# EAGLE design HealthMonitor (EAGLE 9.5.0)

## Sheet 1 of 2
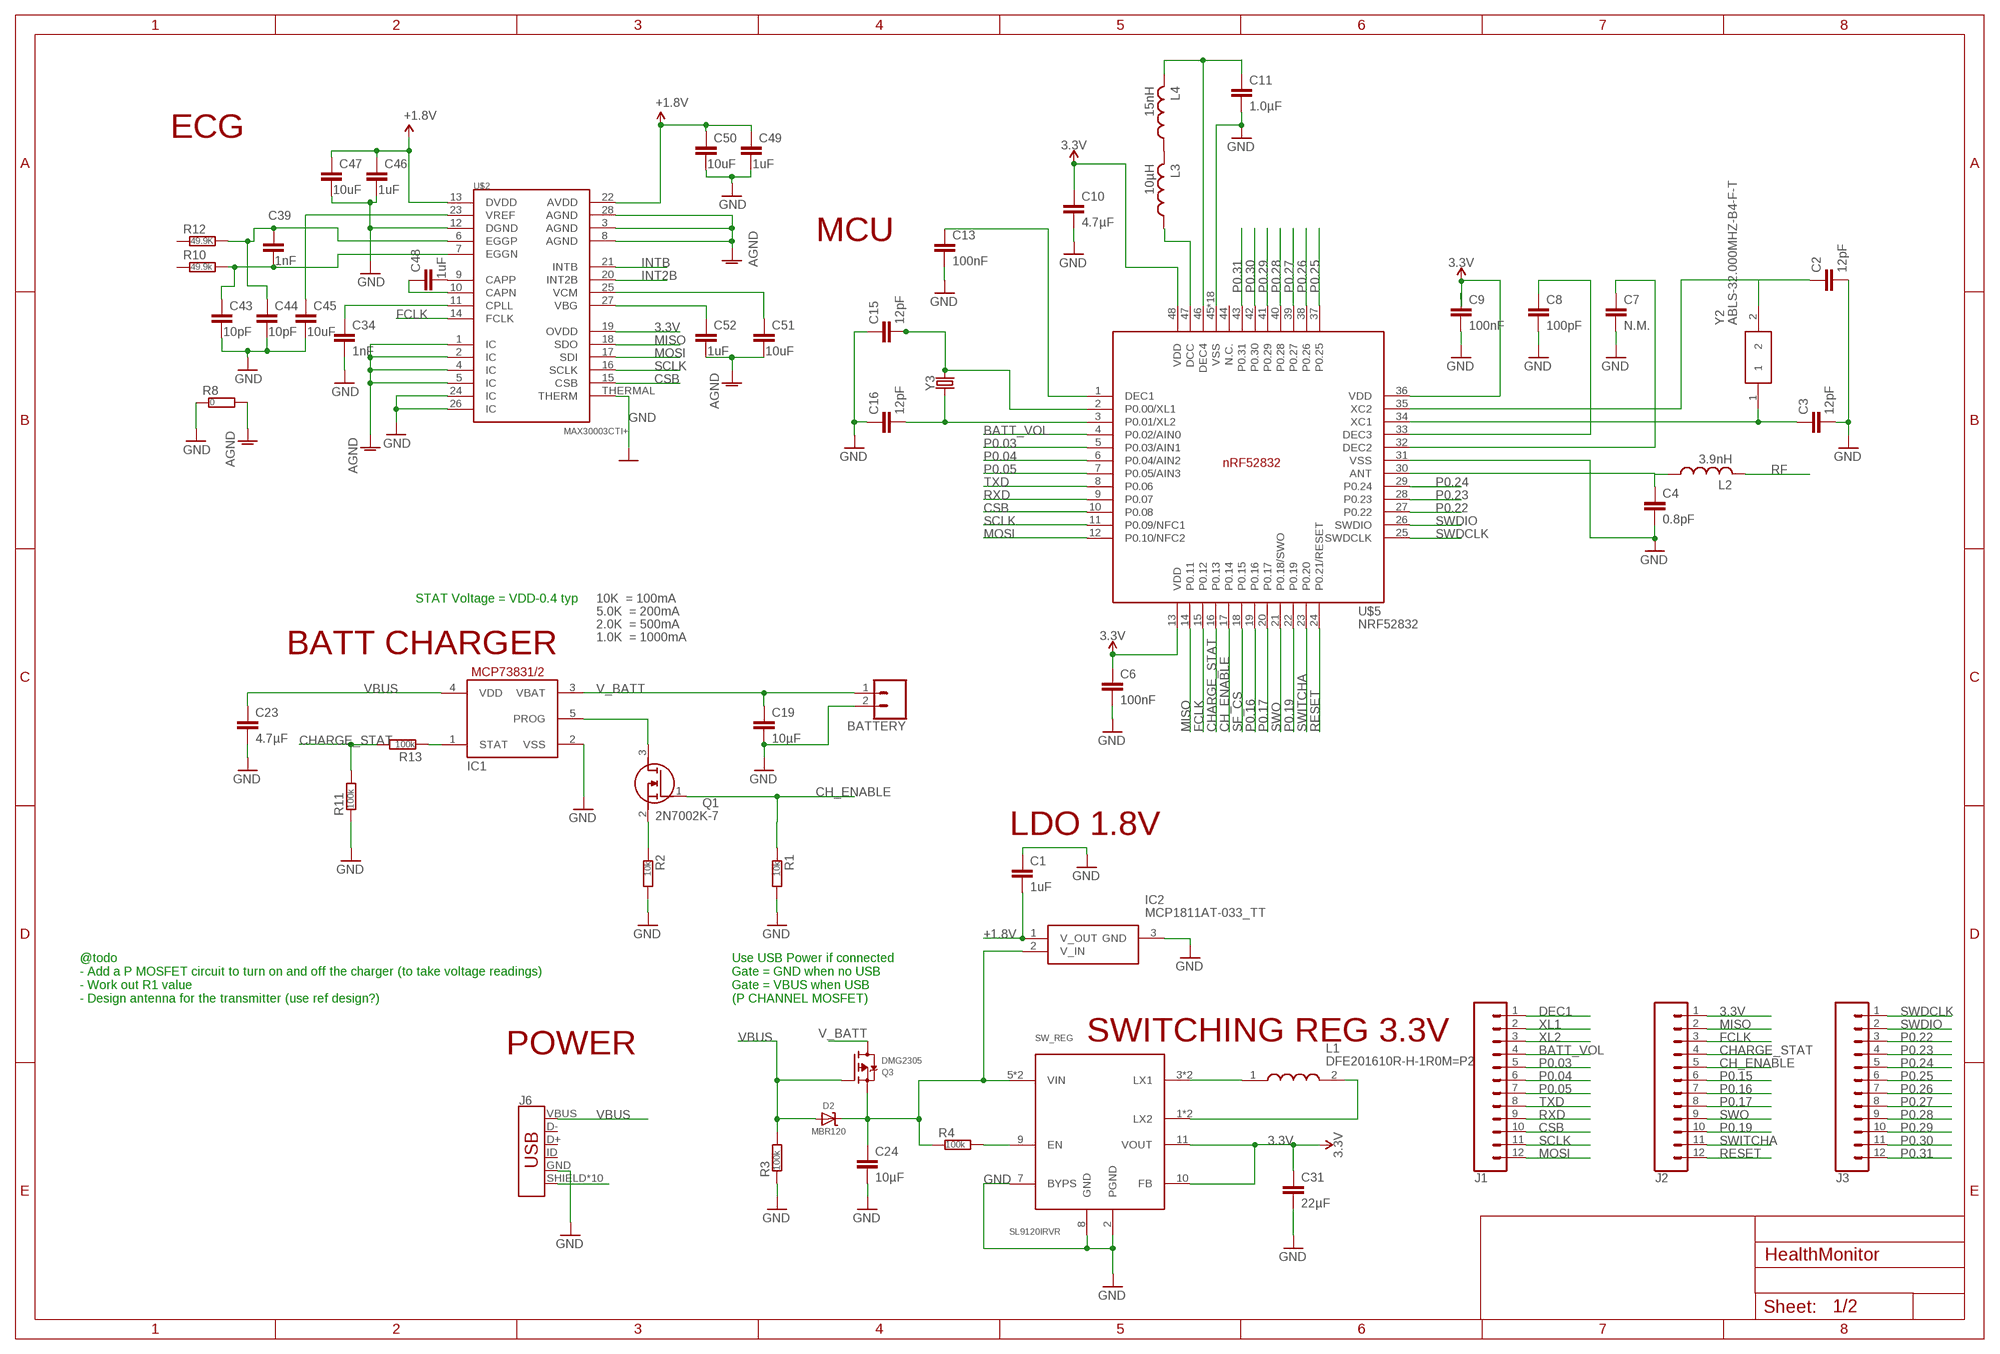
[diagram p0: schematic, sheet 1]

### Parts
BATTERY  CONN_02  [1X02]
C1  1uF  CAPACITOR_0603_L  [RESC0603_L]
C2  12pF  CAPACITOR_0603_L  [RESC0603_L]
C3  12pF  CAPACITOR_0603_L  [RESC0603_L]
C4  0.8pF  CAPACITOR_0603_L  [RESC0603_L]
C6  100nF  CAPACITOR_0603_L  [RESC0603_L]
C7  N.M.  CAPACITOR_0603_L  [RESC0603_L]
C8  100pF  CAPACITOR_0603_L  [RESC0603_L]
C9  100nF  CAPACITOR_0603_L  [RESC0603_L]
C10  4.7µF  CAPACITOR_0603_N  [RESC0603_N]
C11  1.0µF  CAPACITOR_0603_N  [RESC0603_N]
C13  100nF  CAPACITOR_0603_L  [RESC0603_L]
C15  12pF  CAPACITOR_0603_L  [RESC0603_L]
C16  12pF  CAPACITOR_0603_L  [RESC0603_L]
C19  10µF  CAPACITOR_0603_N  [RESC0603_N]
C23  4.7µF  CAPACITOR_0603_N  [RESC0603_N]
C24  10µF  CAPACITOR_0603_N  [RESC0603_N]
C31  22µF  CAPACITOR_0603_N  [RESC0603_N]
C34  1nF  C-EUC0603  [C0603]
C39  1nF  CAPACITOR_0603_N  [RESC0603_N]
C43  10pF  CAPACITOR_0603_N  [RESC0603_N]
C44  10pF  CAPACITOR_0603_N  [RESC0603_N]
C45  10uF  CAPACITOR_0603_N  [RESC0603_N]
C46  1uF  CAPACITOR_0603_N  [RESC0603_N]
C47  10uF  CAPACITOR_0603_N  [RESC0603_N]
C48  1uF  CAPACITOR_0603_N  [RESC0603_N]
C49  1uF  CAPACITOR_0603_N  [RESC0603_N]
C50  10uF  CAPACITOR_0603_N  [RESC0603_N]
C51  10uF  CAPACITOR_0603_N  [RESC0603_N]
C52  1uF  CAPACITOR_0603_N  [RESC0603_N]
D2  MBR120  DIODE-SCHOTTKYSOD-123  [SOD-123]
IC1  MCP73831/OT  [SOT23-5L]
IC2  MCP1811AT-033_TT  [SOT95P237X112-3N]
J1  CONN_12  [1X12]
J2  CONN_12  [1X12]
J3  CONN_12  [1X12]
J6  USB_MICRO-B_HALF_PTH_MILL  [USB-MICROB-PTH-MILL]
L1  DFE201610R-H-1R0M=P2  [INDC2016X100N]
L2  3.9nH  INDUCTOR_0402_N  [RESC0402_N]
L3  10µH  INDUCTOR_0603_N  [RESC0603_N]
L4  15nH  INDUCTOR_0402_N  [RESC0402_N]
Q1  2N7002K-7  [SOT96P240X100-3N]
Q3  DMG2305  MOSFET-P  [SOT23-R]
R1  10k  RESISTOR_0603_L  [RESC0603_L]
R2  10k  RESISTOR_0603_L  [RESC0603_L]
R3  100k  RESISTOR_0603_L  [RESC0603_L]
R4  100k  RESISTOR_0603_L  [RESC0603_L]
R8  0  RESISTOR_0603_L  [RESC0603_L]
R10  49.9k  RESISTOR_0603_L  [RESC0603_L]
R11  100k  RESISTOR_0603_L  [RESC0603_L]
R12  49.9K  RESISTOR_0603_L  [RESC0603_L]
R13  100k  RESISTOR_0603_L  [RESC0603_L]
SW_REG  SL9120IRVR  [TQFN-12]
U$2  MAX30003CTI+  MAX30003  [QFN-28]
U$5  NRF52832  [QFN40P600X600X90-48_N]
Y2  ABLS-32.000MHZ-B4-F-T  [ABLS-12.000MHZ-B2]
Y3  CRYSTALSMD-2X6  [CRYSTAL-SMD-2X6-CYL]

### Nets
3.3V: C6.1 C9.1 C10.1 C31.1 J2.1 SW_REG.10(FB) SW_REG.11(VOUT) U$2.19(OVDD) U$5.13(VDD) U$5.36(VDD) U$5.48(VDD) ; also sheet 2
+1.8V: C1.2 C46.1 C47.1 C49.1 C50.1 IC2.1(V_OUT) U$2.13(DVDD) U$2.22(AVDD) ; also sheet 2
AGND: C51.2 C52.2 R8.2 U$2.1(IC) U$2.2(IC) U$2.3(AGND) U$2.4(IC) U$2.5(IC) U$2.8(AGND) U$2.28(AGND)
BATT_VOL: J1.4 U$5.4(P0.02/AIN0) ; also sheet 2
CH_ENABLE: J2.5 Q1.1(G) R1.1 U$5.17(P0.14)
CHARGE_STAT: J2.4 R11.2 R13.2 U$5.16(P0.13)
CSB: J1.10 U$2.15(CSB) U$5.10(P0.08)
DEC1: J1.1
ECGN1: C39.2 C43.1 R10.2 U$2.7(EGGN)
ECGP1: C39.1 C44.1 R12.2 U$2.6(EGGP)
FCLK: J2.3 U$2.14(FCLK) U$5.15(P0.12)
GND: BATTERY.2 C1.1 C2.2 C3.2 C4.2 C6.2 C7.2 C8.2 C9.2 C10.2 C11.2 C13.2 C15.1 C16.1 C19.2 C23.2 C24.2 C31.2 C34.2 C43.2 C44.2 C45.2 C46.2 C47.2 C49.2 C50.2 IC1.2(VSS) IC2.3(GND) J6.GND R1.2 R2.2 R3.1 R8.1 R11.1 SW_REG.2(PGND) SW_REG.7(BYPS) SW_REG.8(GND) U$2.12(DGND) U$2.24(IC) U$2.26(IC) U$2.THERMAL(THERM) U$5.31(VSS) U$5.45(VSS) U$5.PAD(VSS) U$5.PAD@VIA01(VSS) U$5.PAD@VIA02(VSS) U$5.PAD@VIA03(VSS) U$5.PAD@VIA04(VSS) U$5.PAD@VIA05(VSS) U$5.PAD@VIA06(VSS) U$5.PAD@VIA07(VSS) U$5.PAD@VIA08(VSS) U$5.PAD@VIA09(VSS) U$5.PAD@VIA10(VSS) U$5.PAD@VIA11(VSS) U$5.PAD@VIA12(VSS) U$5.PAD@VIA13(VSS) U$5.PAD@VIA14(VSS) U$5.PAD@VIA15(VSS) U$5.PAD@VIA16(VSS) ; also sheet 2
INT2B: U$2.20(INT2B)
INTB: U$2.21(INTB)
MISO: J2.2 U$2.18(SDO) U$5.14(P0.11) ; also sheet 2
MOSI: J1.12 U$2.17(SDI) U$5.12(P0.10/NFC2) ; also sheet 2
N$1: R4.2 SW_REG.9(EN)
N$2: IC1.1(STAT) R13.1
N$3: Q1.2(S) R2.1
N$4: C13.1 U$5.1(DEC1)
N$5: L1.1 SW_REG.3(LX1) SW_REG.4(LX1)
N$6: C24.1 D2.C IC2.2(V_IN) Q3.2(S) R4.1 SW_REG.5(VIN) SW_REG.6(VIN)
N$7: IC1.5(PROG) Q1.3(D)
N$8: L1.2 SW_REG.1(LX2) SW_REG.12(LX2)
N$9: C51.1 U$2.25(VCM)
N$10: C2.1 Y2.2
N$11: L3.2 L4.1
N$12: L3.1 U$5.47(DCC)
N$13: C16.2 U$5.3(P0.01/XL2) Y3.X1
N$14: C3.1 U$5.34(XC1) Y2.1
N$15: C4.1 L2.1
N$17: C34.1 U$2.11(CPLL)
N$18: C48.1 U$2.10(CAPN)
N$19: C45.1 U$2.23(VREF)
N$20: C52.1 U$2.27(VBG)
N$21: U$5.30(ANT)
N$22: C7.1 U$5.32(DEC2)
N$23: C48.2 U$2.9(CAPP)
N$24: C11.1 L4.2 U$5.46(DEC4)
N$29: C8.1 U$5.33(DEC3)
N$31: U$5.35(XC2)
P0.03: J1.5 U$5.5(P0.03/AIN1)
P0.04: J1.6 U$5.6(P0.04/AIN2)
P0.05: J1.7 U$5.7(P0.05/AIN3)
P0.15: J2.6
P0.16: J2.7 U$5.19(P0.16)
P0.17: J2.8 U$5.20(P0.17)
P0.19: J2.10 U$5.22(P0.19)
P0.22: J3.3 U$5.27(P0.22)
P0.23: J3.4 U$5.28(P0.23)
P0.24: J3.5 U$5.29(P0.24)
P0.25: J3.6 U$5.37(P0.25)
P0.26: J3.7 U$5.38(P0.26)
P0.27: J3.8 U$5.39(P0.27)
P0.28: J3.9 U$5.40(P0.28)
P0.29: J3.10 U$5.41(P0.29)
P0.30: J3.11 U$5.42(P0.30)
P0.31: J3.12 U$5.43(P0.31)
RESET: J2.12 U$5.24(P0.21/RESET) ; also sheet 2
RF: L2.2
RXD: J1.9 U$5.9(P0.07) ; also sheet 2
SCLK: J1.11 U$2.16(SCLK) U$5.11(P0.09/NFC1) ; also sheet 2
SF_CS: U$5.18(P0.15) ; also sheet 2
SHIELD: J6.SHIELD J6.SHIELD2(SHIELD) J6.SHIELD3(SHIELD) J6.SHIELD4(SHIELD) J6.SHIELD5(SHIELD) J6.SHIELD6(SHIELD) J6.SHIELD7(SHIELD) J6.SHIELD8(SHIELD) J6.SHIELD9(SHIELD) J6.SHIELD10(SHIELD)
SWDCLK: J3.1 U$5.25(SWDCLK)
SWDIO: J3.2 U$5.26(SWDIO) ; also sheet 2
SWITCHA: J2.11 U$5.23(P0.20) ; also sheet 2
SWO: J2.9 U$5.21(P0.18/SWO)
TXD: J1.8 U$5.8(P0.06) ; also sheet 2
V_BATT: BATTERY.1 C19.1 IC1.3(VBAT) Q3.3(D) ; also sheet 2
VBUS [power]: C23.1 D2.A IC1.4(VDD) J6.VBUS Q3.1(G) R3.2
XL1: C15.2 J1.2 U$5.2(P0.00/XL1) Y3.X2
XL2: J1.3
Unconnected: J6.D+ J6.D- J6.ID R10.1 R12.1 U$5.44(N.C.)

### Notes on the sheet
- ECG
- MCU
- STAT Voltage = VDD-0.4 typ | 10K  = 100mA
- 5.0K  = 200mA
- 2.0K  = 500mA
- 1.0K  = 1000mA
- BATT CHARGER
- LDO 1.8V
- @todo 
  - Add a P MOSFET circuit to turn on and off the charger (to take voltage readings) 
  - Work out R1 value 
  - Design antenna for the transmitter (use ref design?)
- Use USB Power if connected
  Gate = GND when no USB 
  Gate = VBUS when USB 
  (P CHANNEL MOSFET)
- SWITCHING REG 3.3V
- POWER

## Sheet 2 of 2
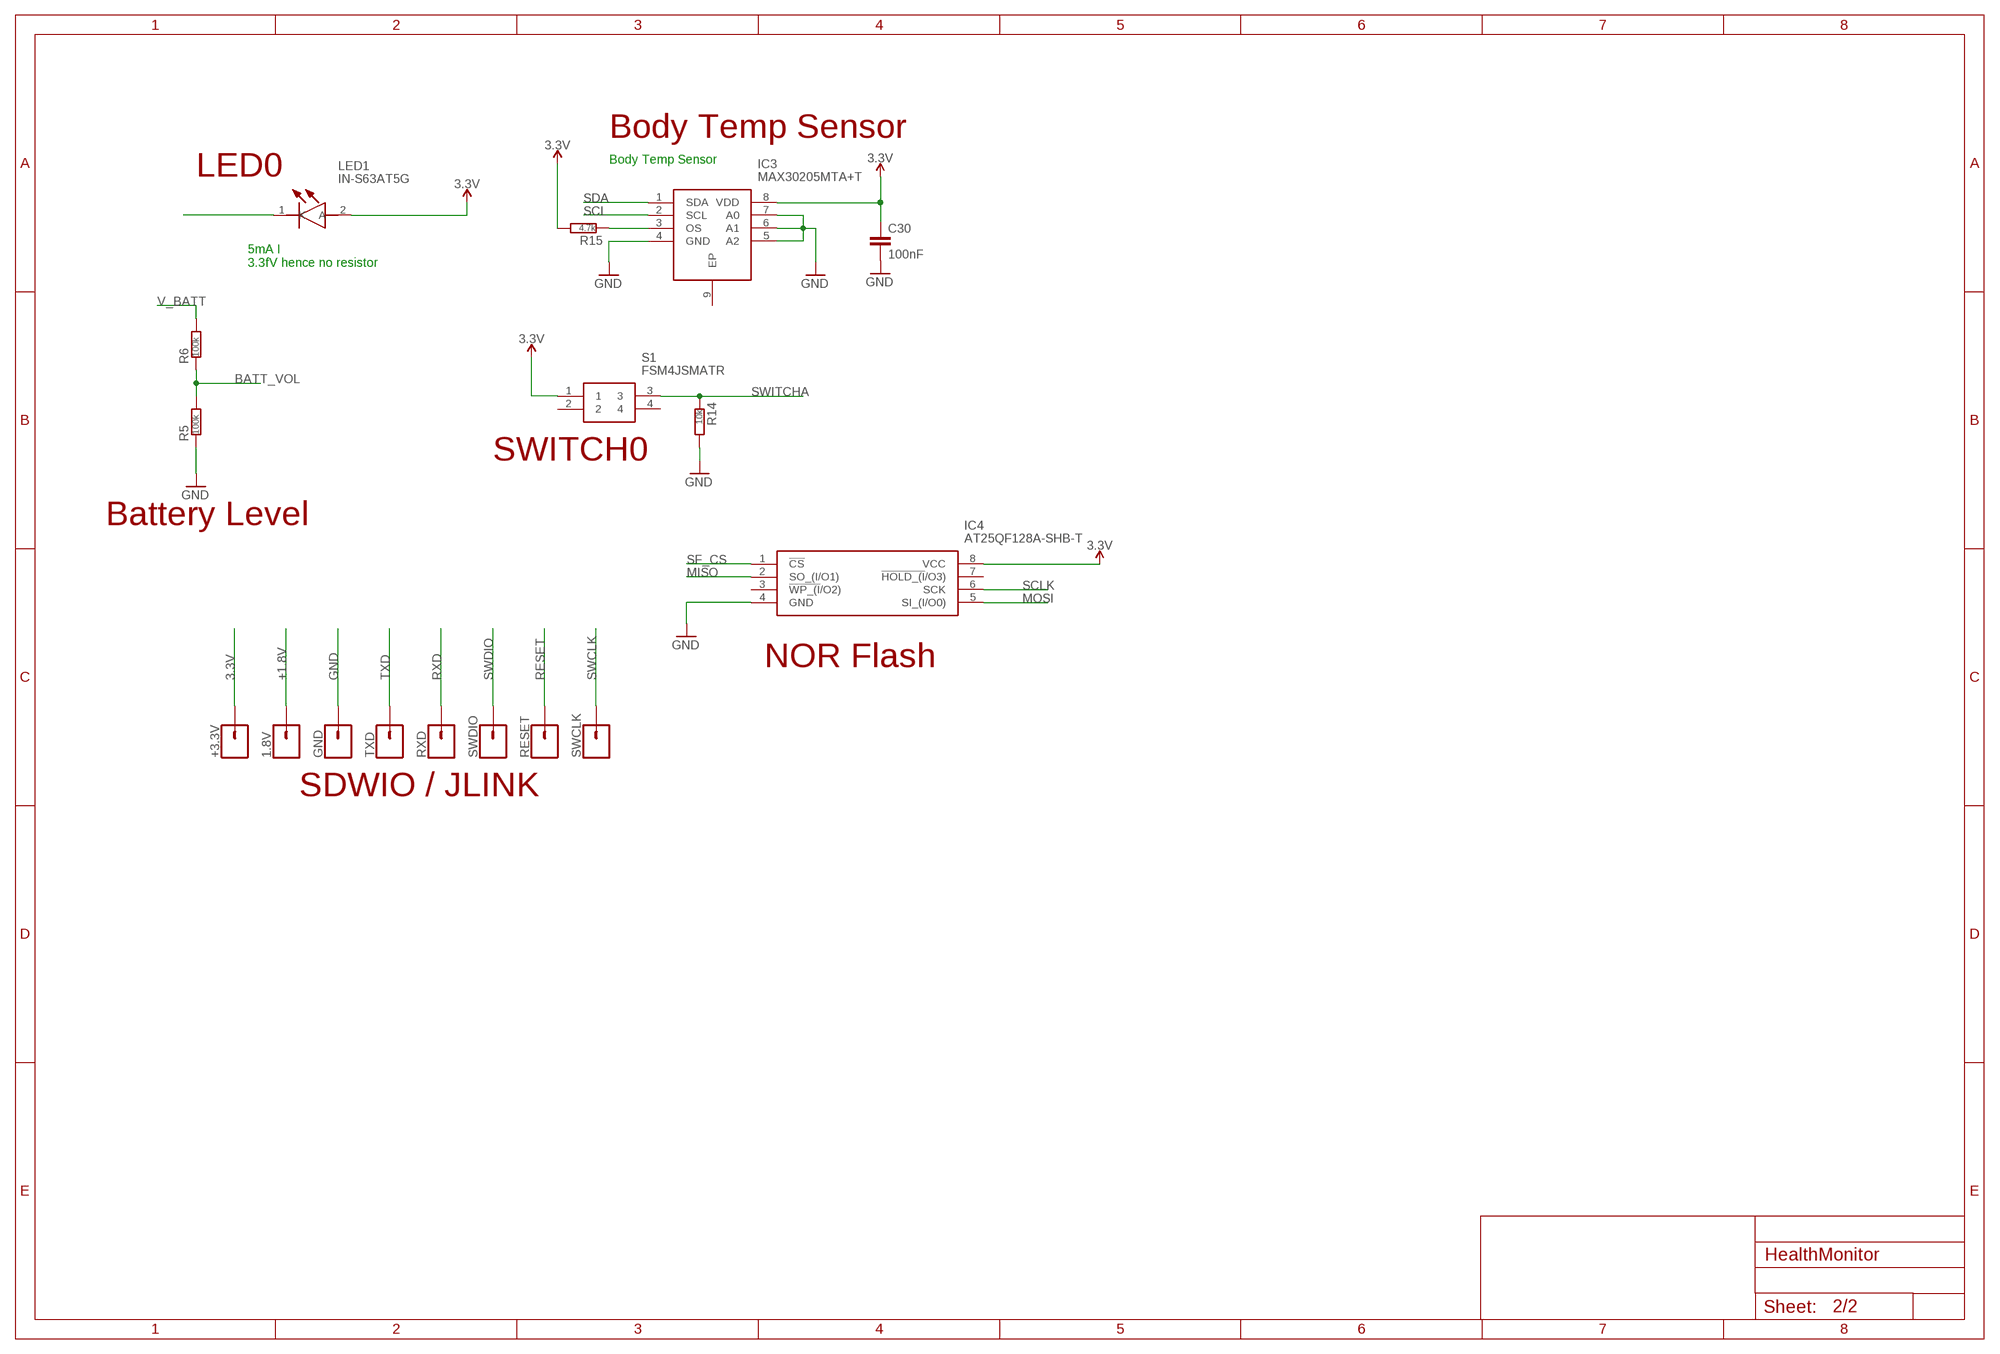
[diagram p1: schematic, sheet 2]

### Parts
1.8V  CONN_01  [1X01]
+3.3V  CONN_01  [1X01]
C30  100nF  CAPACITOR_0603_L  [RESC0603_L]
GND  CONN_01  [1X01]
IC3  MAX30205MTA+T  [SON65P300X300X80-9N]
IC4  AT25QF128A-SHB-T  [SOIC127P790X216-8N]
LED1  IN-S63AT5G  [LEDM168X39N]
R5  100k  RESISTOR_0603_L  [RESC0603_L]
R6  100k  RESISTOR_0603_L  [RESC0603_L]
R14  10k  RESISTOR_0603_L  [RESC0603_L]
R15  4.7k  RESISTOR_0603_L  [RESC0603_L]
RESET  CONN_01  [1X01]
RXD  CONN_01  [1X01]
S1  FSM4JSMATR  [FSM4JSMATR]
SWCLK  CONN_01  [1X01]
SWDIO  CONN_01  [1X01]
TXD  CONN_01  [1X01]

### Nets
3.3V: +3.3V.1 C30.1 IC3.8(VDD) IC4.8(VCC) LED1.2(A) R15.2 S1.1 ; also sheet 1
+1.8V: 1.8V.1 ; also sheet 1
BATT_VOL: R5.2 R6.1 ; also sheet 1
GND: C30.2 GND.1 IC3.4(GND) IC3.5(A2) IC3.6(A1) IC3.7(A0) IC4.4(GND) R5.1 R14.2 ; also sheet 1
LEDA: LED1.1(K)
MISO: IC4.2(SO_(I/O1)) ; also sheet 1
MOSI: IC4.5(SI_(I/O0)) ; also sheet 1
N$16: IC3.3(OS) R15.1
RESET: RESET.1 ; also sheet 1
RXD: RXD.1 ; also sheet 1
SCL: IC3.2(SCL)
SCLK: IC4.6(SCK) ; also sheet 1
SDA: IC3.1(SDA)
SF_CS: IC4.1(!CS) ; also sheet 1
SWCLK: SWCLK.1
SWDIO: SWDIO.1 ; also sheet 1
SWITCHA: R14.1 S1.3 ; also sheet 1
TXD: TXD.1 ; also sheet 1
V_BATT: R6.2 ; also sheet 1
Unconnected: IC3.9(EP) IC4.3(!WP_(I!/O2)) IC4.7(!HOLD_(I!/O3)) S1.2 S1.4

### Notes on the sheet
- Body Temp Sensor
- Body Temp Sensor
- LED0
- 5mA I
  3.3fV hence no resistor
- SWITCH0
- Battery Level
- NOR Flash
- SDWIO / JLINK

## Library data of the parts
1.8V +3.3V GND RESET RXD SWCLK SWDIO TXD = SparkFun-Connectors:CONN_01: Single connection point. Often used as Generic Header-pin footprint for 0.1 inch spaced/style header connections On any of the 0.1 inch spaced packages, you can populate with these: Break Away Headers - Straight <https://www.sparkfun.com/products/116> (PRT-00116) Break Away Male Headers - Right Angle <https://www.sparkfun.com/products/553> (PRT-00553) Female Headers <https://www.sparkfun.com/products/115> (PRT-00115) Break Away Headers - Machine Pin <https://www.sparkfun.com/products/117> (PRT-00117) Break Away Female Headers - Swiss Machine Pin <https://www.sparkfun.com/products/743> (PRT-00743) This device is also useful as a general connection point to wire up your design to another part of your project. Our various solder wires solder well into these plated through hole pads. Hook-Up Wire - Assortment (Stranded, 22 AWG) <https://www.sparkfun.com/products/11375> (PRT-11375) Hook-Up Wire - Assortment (Solid Core, 22 AWG) <https://www.sparkfun.com/products/11367> (PRT-11367) View the entire wire category on our website here <https://www.sparkfun.com/categories/141> Special notes: SMTSO-256-ET is a "flush mount" nut for a 4-40 screw. We mostly use this on specialty testbeds; it is a nice way to connect hardware to your PCB at an adjustable hieght. Also note, the SNAP packages are for using a snappable style connector. We sell a baggie of snaps and they are also used on two LilyPad designs: Snap Assortment - 30 pack (male and female) <https://www.sparkfun.com/products/11347> (DEV-11347) LilyPad Arduino SimpleSnap <https://www.sparkfun.com/products/10941> (DEV-10941) LilyPad SimpleSnap Protoboard <https://www.sparkfun.com/products/10940> (DEV-10940)
BATTERY = SparkFun-Connectors:CONN_02: Multi connection point. Often used as Generic Header-pin footprint for 0.1 inch spaced/style header connections On any of the 0.1 inch spaced packages, you can populate with these: Break Away Headers - Straight <https://www.sparkfun.com/products/116> (PRT-00116) Break Away Male Headers - Right Angle <https://www.sparkfun.com/products/553> (PRT-00553) Female Headers <https://www.sparkfun.com/products/115> (PRT-00115) Break Away Headers - Machine Pin <https://www.sparkfun.com/products/117> (PRT-00117) Break Away Female Headers - Swiss Machine Pin <https://www.sparkfun.com/products/743> (PRT-00743) For SCREWTERMINALS and SPRING TERMINALS visit here: Screw Terimnals on SparkFun.com <https://www.sparkfun.com/search/results?term=Screw+Terminals> (5mm/3.5mm/2.54mm spacing) This device is also useful as a general connection point to wire up your design to another part of your project. Our various solder wires solder well into these plated through hole pads. Hook-Up Wire - Assortment (Stranded, 22 AWG) <https://www.sparkfun.com/products/11375> (PRT-11375) Hook-Up Wire - Assortment (Solid Core, 22 AWG) <https://www.sparkfun.com/products/11367> (PRT-11367) View the entire wire category on our website here <https://www.sparkfun.com/categories/141> Special notes: Molex polarized connector foot print use with: PRT-08233 with associated crimp pins and housings. 2.54_SCREWTERM for use with PRT-10571. 3.5mm Screw Terminal footprints for PRT-08084 5mm Screw Terminal footprints for use with PRT-08432
C1-C4 C6-C11 C13 C15 C16 C19 C23 C24 C30 C31 C39 C43-C52 = Nordic_nRF:CAPACITOR: Generic chip capacitor
C34 = rcl:C-EU: CAPACITOR, European symbol
D2 = microbuilder:DIODE-SCHOTTKY
IC1 = adafruit:MCP73831: MCP73831/2 Miniature Single-Cell, Fully Integrated Li-Ion, Li-Polymer Charge Management Controllers. Nice and small simple lipoly charge controller, with adjustable current and status output (LED) http://www.ladyada.net/library/pcb/eaglelibrary.html
IC2 = SamacSys_Parts:MCP1811AT-033_TT: LDO Voltage Regulators Ultra Low Iq LDO Source: Datasheet <https://componentsearchengine.com/Datasheets/1/MCP1811AT-033_TT.pdf>; DESCRIPTION: LDO Voltage Regulators Ultra Low Iq LDO; HEIGHT: 1.12mm; MANUFACTURER_NAME: Microchip; MANUFACTURER_PART_NUMBER: MCP1811AT-033/TT; MOUSER_PART_NUMBER: 579-MCP1811AT-033/TT; MOUSER_PRICE-STOCK: https://www.mouser.com/Search/Refine.aspx?Keyword=579-MCP1811AT-033%2FTT
IC3 = SamacSys_Parts:MAX30205MTA+T: Human Body Temperature Sensor, 8 TDFN-EP Source: Datasheet <https://datasheets.maximintegrated.com/en/ds/MAX30205.pdf>; DESCRIPTION: Human Body Temperature Sensor, 8 TDFN-EP; HEIGHT: 0.8mm; MANUFACTURER_NAME: Maxim Integrated; MANUFACTURER_PART_NUMBER: MAX30205MTA+T; MOUSER_PART_NUMBER: 700-MAX30205MTA+T; MOUSER_PRICE-STOCK: https://www.mouser.com/Search/Refine.aspx?Keyword=700-MAX30205MTA%2BT
IC4 = SamacSys_Parts:AT25QF128A-SHB-T: NOR Flash 128Mb, 133MHz, QPI,8-SOIC-W, IND TEMP, 2.7-3.6V, T&R Source: Datasheet <https://www.adestotech.com/wp-content/uploads/AT25QF128A_Data_Sheet_RevA_03-19-2019-1.pdf>; DESCRIPTION: NOR Flash 128Mb, 133MHz, QPI,8-SOIC-W, IND TEMP, 2.7-3.6V, T&R; HEIGHT: 2.16mm; MANUFACTURER_NAME: Adesto Technologies; MANUFACTURER_PART_NUMBER: AT25QF128A-SHB-T; MOUSER_PART_NUMBER: 988-AT25QF128A-SHB-T; MOUSER_PRICE-STOCK: https://www.mouser.com/Search/Refine.aspx?Keyword=988-AT25QF128A-SHB-T
J1-J3 = SparkFun-Connectors:CONN_12: Multi connection point. Often used as Generic Header-pin footprint for 0.1 inch spaced/style header connections On any of the 0.1 inch spaced packages, you can populate with these: Break Away Headers - Straight <https://www.sparkfun.com/products/116> (PRT-00116) Break Away Male Headers - Right Angle <https://www.sparkfun.com/products/553> (PRT-00553) Female Headers <https://www.sparkfun.com/products/115> (PRT-00115) Break Away Headers - Machine Pin <https://www.sparkfun.com/products/117> (PRT-00117) Break Away Female Headers - Swiss Machine Pin <https://www.sparkfun.com/products/743> (PRT-00743) For SCREWTERMINALS and SPRING TERMINALS visit here: Screw Terimnals on SparkFun.com <https://www.sparkfun.com/search/results?term=Screw+Terminals> (5mm/3.5mm/2.54mm spacing) This device is also useful as a general connection point to wire up your design to another part of your project. Our various solder wires solder well into these plated through hole pads. Hook-Up Wire - Assortment (Stranded, 22 AWG) <https://www.sparkfun.com/products/11375> (PRT-11375) Hook-Up Wire - Assortment (Solid Core, 22 AWG) <https://www.sparkfun.com/products/11367> (PRT-11367) View the entire wire category on our website here <https://www.sparkfun.com/categories/141> Special notes: Molex polarized connector foot print use with SKU : PRT-08231 with associated crimp pins and housings. 1MM SMD Version SKU: PRT-10208 NOTES ON THE VARIANTS LOCK and LOCK_LONGPADS... This footprint was designed to help hold the alignment of a through-hole component (i.e. 6-pin header) while soldering it into place. You may notice that each hole has been shifted either up or down by 0.005 of an inch from it's more standard position (which is a perfectly straight line). This slight alteration caused the pins (the squares in the middle) to touch the edges of the holes. Because they are alternating, it causes a "brace" to hold the component in place. 0.005 has proven to be the perfect amount of "off-center" position when using our standard breakaway headers. Although looks a little odd when you look at the bare footprint, once you have a header in there, the alteration is very hard to notice. Also,if you push a header all the way into place, it is covered up entirely on the bottom side.
J6 = SparkFun-Connectors:USB_MICRO-B: USB Type Micro-B Connector Male/female and PTH/SMT variants SparkFun Products: SparkFun microB USB Breakout <https://www.sparkfun.com/products/12035> SparkFun USB microB Plug Breakout <https://www.sparkfun.com/products/10031> SparkFun ESP8266 Thing <https://www.sparkfun.com/products/13231>; PROD_ID: CONN-13711
L1 = SamacSys_Parts:DFE201610R-H-1R0M=P2: DFE201610R Series Inductor 1.0uH +/-20% 0806 (2016) Source: Datasheet <https://psearch.en.murata.com/inductor/product/DFE201610R-H-1R0M#.html>; DESCRIPTION: DFE201610R Series Inductor 1.0uH +/-20% 0806 (2016); HEIGHT: 1mm; MANUFACTURER_NAME: Murata Electronics; MANUFACTURER_PART_NUMBER: DFE201610R-H-1R0M=P2; MOUSER_PART_NUMBER: 81-DFE201610RH1R0MP2; MOUSER_PRICE-STOCK: https://www.mouser.com/Search/Refine.aspx?Keyword=81-DFE201610RH1R0MP2
L2-L4 = Nordic_nRF:INDUCTOR: Generic chip inductor
LED1 = SamacSys_Parts:IN-S63AT5G: Standard LEDs - SMD True Green LED Source: Datasheet <http://www.inolux-corp.com/datasheet/SMDLED/Mono Color Top View/IN-S63AT Series_V1.1.pdf>; DESCRIPTION: Standard LEDs - SMD True Green LED; HEIGHT: 0.39mm; MANUFACTURER_NAME: Inolux; MANUFACTURER_PART_NUMBER: IN-S63AT5G; MOUSER_PART_NUMBER: 743-IN-S63AT5G; MOUSER_PRICE-STOCK: https://www.mouser.com/Search/Refine.aspx?Keyword=743-IN-S63AT5G
Q1 = SamacSys_Parts:2N7002K-7: N-CHANNEL ENHANCEMENT MODE MOSFET Source: Datasheet <https://www.diodes.com/assets/Datasheets/ds30896.pdf>; ALLIED_NUMBER: 70437208; ALLIED_PRICE-STOCK: https://www.alliedelec.com/diodes-inc-2n7002k-7/70437208/; DESCRIPTION: N-CHANNEL ENHANCEMENT MODE MOSFET; HEIGHT: 1mm; MANUFACTURER_NAME: Diodes Inc.; MANUFACTURER_PART_NUMBER: 2N7002K-7; MOUSER_PART_NUMBER: 621-2N7002K-7; MOUSER_PRICE-STOCK: https://www.mouser.com/Search/Refine.aspx?Keyword=621-2N7002K-7; RS_PART_NUMBER: 7703383; RS_PRICE-STOCK: https://uk.rs-online.com/web/p/products/7703383
Q3 = microbuilder:MOSFET-P: P-Channel Mosfet LEGEND VDS: Voltage Drain-Source ID: Drain Current RDS(ON): Drain-Source On-State Resistance VGS(TH): Gate-Source Threshold Voltage CISS: Drain-Source Input Capacitance SOT-23 Name VDS ID RDS(ON) VGS(TH) CISS Order Number IRLML5103 30V 760mA 600 mOhm -- 75pF @ 25V Digikey: IRLML5103PBFCT-ND IRLML6401 12V 4.3A 50 mOhm 950mV @ 250µA 830pF @ 10V Digikey: IRLML6401PBFTR-ND NTR0202PL 20V 400mA 800 mOhm 2.3V @ 250uA 70pF @ 5V Digikey: NTR0202PLT1GOSTR-ND NTR4101PT1G 20V 1.8A 85 mOhm 1.2V @ 250uA 675pF @ 10V Digikey: NTR4101PT1GOSCT-ND DMP2004K 20V 600mA 900 mOhm 1V @ 250uA 175pF @ 16V Digikey: DMP2004KDICT-ND PMV65XP 20V 3.9A 76 mOhm 950mV @ 1mA 725pF @ 20V Digikey: 568-2358-2-ND TO-252 Name VDS ID RDS(ON) VGS(TH) CISS Order Number AOD417 30V 25A 34 mOhm 3V @ 250µA 920pF @ 15V Digikey: 785-1106-2-ND PowerPak Name VDS ID RDS(ON) VGS(TH) CISS Order Number AON7401 30V 12A 14 mOhm 3V @ 250µA 2600pF @ 15V Digikey: 785-1302-1-ND
R1-R6 R8 R10-R15 = Nordic_misc:RESISTOR: Generic chip resistor
S1 = SamacSys_Parts:FSM4JSMATR: Tactile switch,SMT,SPST,raised actuator Source: Datasheet <http://uk.rs-online.com/webdocs/0ee0/0900766b80ee0747.pdf>; ALLIED_NUMBER: 70156213; ALLIED_PRICE-STOCK: http://www.alliedelec.com/te-connectivity-fsm4jsmatr/70156213/; DESCRIPTION: Tactile switch,SMT,SPST,raised actuator; HEIGHT: mm; MANUFACTURER_NAME: TE Connectivity; MANUFACTURER_PART_NUMBER: FSM4JSMATR; MOUSER_PART_NUMBER: 506-FSM4JSMATR; MOUSER_PRICE-STOCK: https://www.mouser.com/Search/Refine.aspx?Keyword=506-FSM4JSMATR; RS_PART_NUMBER: 7182455P; RS_PRICE-STOCK: http://uk.rs-online.com/web/p/products/7182455P
SW_REG = MasumAhmed:SL9120IR
U$2 = circuitects:MAX30003
U$5 = Nordic_nRFMAV:NRF52832: nRF52832 Features Single chip, highly flexible, 2.4 GHz multi-protocol SoC 32-bit ARM Cortex-M4F Processor 1.7v to 3.6v operation 512kB flash + 64kB RAM Supports concurrent Bluetooth Smart/ANT protocol operation On-chip NFC tag for Out-of-Band (OOB) pairing Up to +4dBm output power -96dBm sensitivity, Bluetooth Smart Thread safe and run-time protected Event driven API On air compatible with nRF24L and nRF24AP series 2 data rates (2Mbps/1Mbps) PPI - maximum flexibility for power-efficient applications and code simplification Automated power management system with automatic power management of each peripheral Configurable I/O mapping for analog and digital I/O 3 x Master/Slave SPI 2 x Two-wire interface (I²C) UART (RTS/CTS) 3 x PWM AES HW encryption Real Time Counter (RTC) Digital microphone interface (PDM) On-chip balun Applications Internet of Things (IoT) Wearables SmartHome sensors Connected white goods Computer peripherals Voice-command smart remotes A4WP ‘Rezence’ wireless charging Beacons Sports and fitness sensors and hubs Connected health products Smart watches RC Toys Interactive games Building automation and sensor networks
Y2 = SamacSys_Parts:ABLS-32.000MHZ-B4-F-T: ABRACON - ABLS-32.000MHZ-B4-F-T - Crystal, 32 MHz, SMD, 11.5mm x 4.7mm, 50 ppm, 18 pF, 30 ppm, ABLS Series Source: Datasheet <https://abracon.com/Resonators/abls.pdf>; DESCRIPTION: ABRACON - ABLS-32.000MHZ-B4-F-T - Crystal, 32 MHz, SMD, 11.5mm x 4.7mm, 50 ppm, 18 pF, 30 ppm, ABLS Series; HEIGHT: mm; MANUFACTURER_NAME: ABRACON; MANUFACTURER_PART_NUMBER: ABLS-32.000MHZ-B4-F-T; MOUSER_PART_NUMBER: 815-ABLS-32.0MF-T; MOUSER_PRICE-STOCK: https://www.mouser.com/Search/Refine.aspx?Keyword=815-ABLS-32.0MF-T
Y3 = SparkFun-Clocks:CRYSTAL: Crystals (Generic) These are passive quartz crystals, which can be used as a clock source for a microcontroller. Crystal's are two-terminal devices. They require external "load" capacitors to generate an oscillating signal.

## Net classes
1 power: width 0.254 mm

## Board
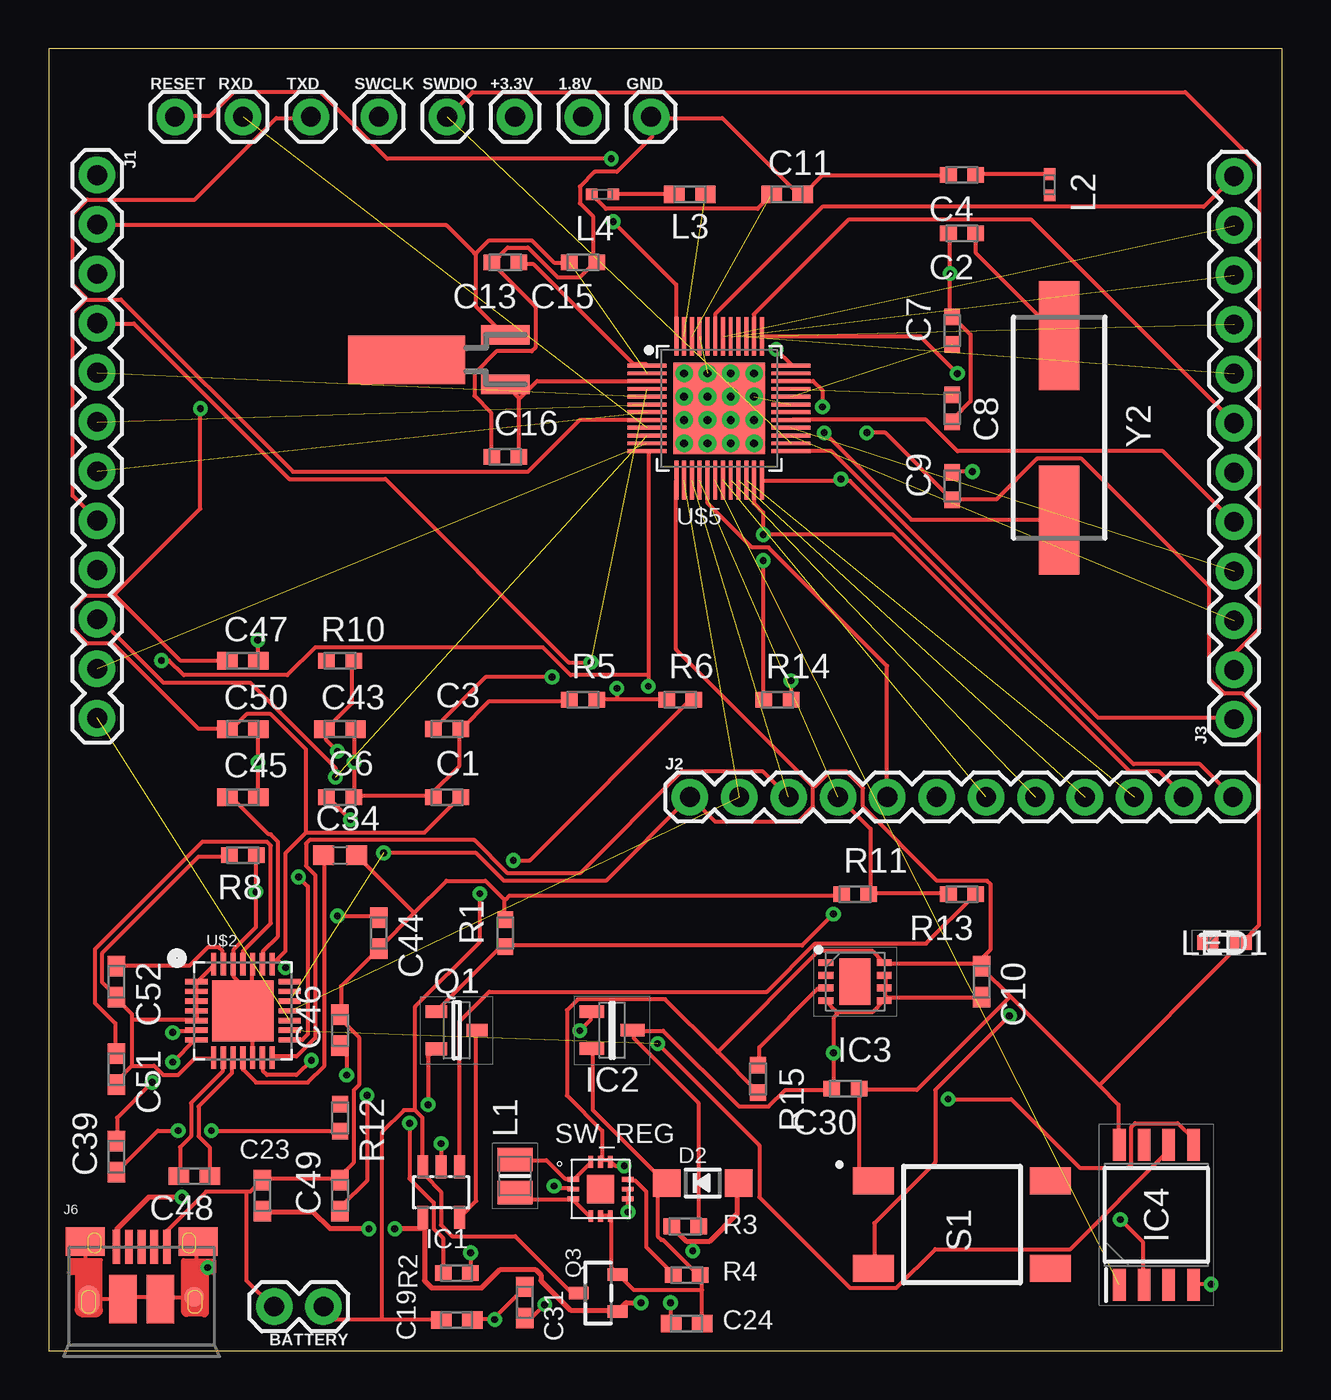
[diagram p2: board, top side]
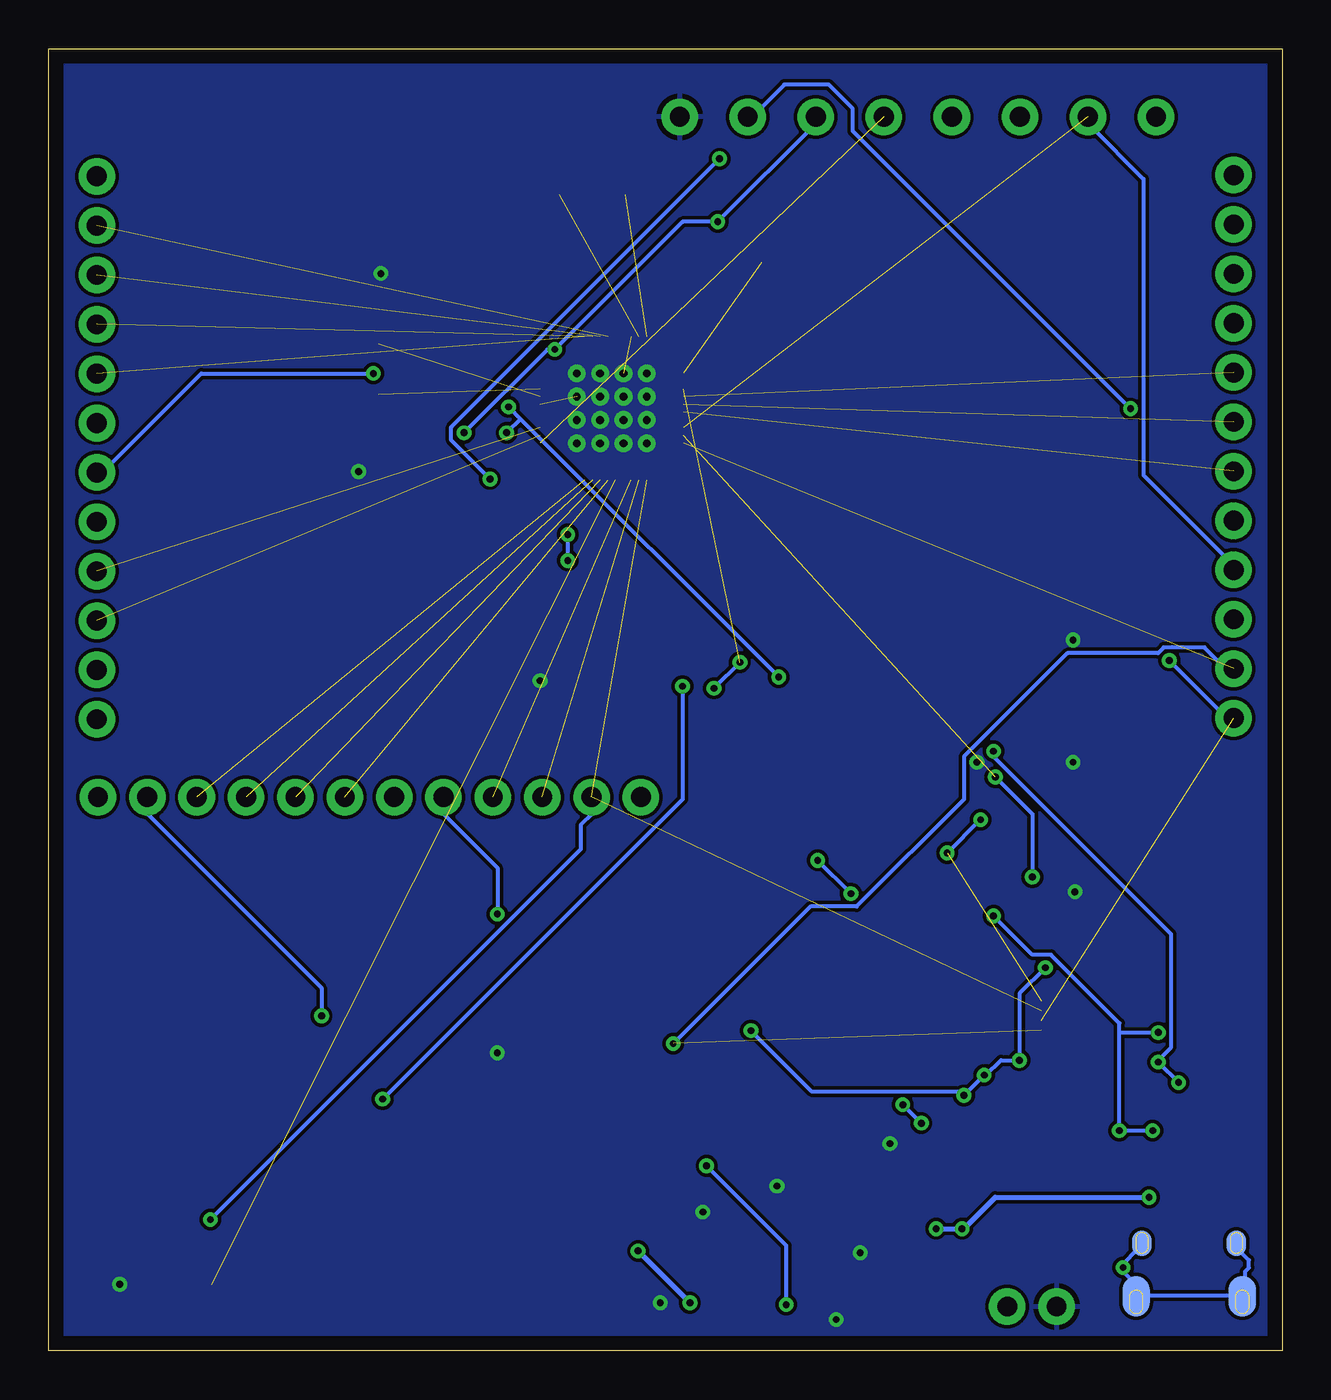
[diagram p3: board, bottom side, seen from below]

Size 63.48 x 67.01 mm. Coordinates in mm from the lower left corner, seen from the top.
Outline: 0,0 63.48,0 63.48,67.01 0,67.01 0,0
Copper layers (1*16): Top 0.035mm / dielectric 1.5mm / Bottom 0.035mm
Design rules "default *": minimum track width 8mil, minimum drill 0.35mm, track to track 7mil, track to pad 7mil, pad to pad 7mil, via to via 7mil, smd to smd 7mil, copper to edge 30mil, drill to drill 7mil, minimum pad ring 10mil, minimum via ring 8mil, stop-mask expansion 4mil, vias tented up to drill 0mil, thermal gap 10mil

### Footprints (pad centres in the part's own frame; a part is rotated, then mirrored left to right if it is on the bottom)
1X01 = drill 1.016 pad 1.88: 1 0,0
1X02 = drill 1.016 pad 1.88: 1 0,0; 2 2.54,0
RESC0603_L = smd 0.85 x 0.8: 1 -0.7,0; 2 0.7,0
RESC0603_N = smd 1.05 x 0.9: 1 -0.8,0; 2 0.8,0
C0603 = smd 1.1 x 1: 1 -0.85,0; 2 0.85,0
SOD-123 = smd 1.4 x 1.4: A 1.85,0; C -1.85,0
SOT23-5L = smd 0.55 x 1.2: 1 -0.95,-1.3; 2 0,-1.3; 3 0.95,-1.3; 4 0.95,1.3; 5 -0.95,1.3
SOT95P237X112-3N = smd 1.25 x 0.65: 1 -1.05,0.95; 2 -1.05,-0.95; 3 1.05,0
SON65P300X300X80-9N = smd 0.75 x 0.35: 1 -1.5,0.975; 2 -1.5,0.325; 3 -1.5,-0.325; 4 -1.5,-0.975; 5 1.5,-0.975; 6 1.5,-0.325; 7 1.5,0.325; 8 1.5,0.975 | smd 1.6 x 2.4: 9 0,0
SOIC127P790X216-8N = smd 1.65 x 0.65: 1 -3.6,1.905; 2 -3.6,0.635; 3 -3.6,-0.635; 4 -3.6,-1.905; 5 3.6,-1.905; 6 3.6,-0.635; 7 3.6,0.635; 8 3.6,1.905
1X12 = drill 1.016 pad 1.88: 1 0,0; 2 2.54,0; 3 5.08,0; 4 7.62,0; 5 10.16,0; 6 12.7,0; 7 15.24,0; 8 17.78,0; 9 20.32,0; 10 22.86,0; 11 25.4,0; 12 27.94,0
USB-MICROB-PTH-MILL = smd 0.4 x 1.75: D+ 0,0; D- -0.65,0; GND 1.3,0; ID 0.65,0; VBUS -1.3,0 | smd 2 x 1.46: SHIELD -2.9,0.275; SHIELD2 2.9,0.275 | smd 1.425 x 2.5: SHIELD3 -0.963,-2.675; SHIELD4 0.963,-2.675 | smd 1.4 x 2.1 bottom: SHIELD5 -2.731,-2.531; SHIELD7 2.729,-2.531 | smd 1 x 1: SHIELD6 2.7,-2.575 | smd 1.1 x 1.5: SHIELD8 -2.731,-2.731 | smd 1 x 1.3 bottom: SHIELD9 -2.43,0.195; SHIELD10 2.43,0.195
INDC2016X100N = smd 1.2 x 1.8: 1 -0.85,0; 2 0.85,0
RESC0402_N = smd 0.6 x 0.6: 1 -0.55,0; 2 0.55,0
LEDM168X39N = smd 1.1 x 0.75: 1 -0.85,0; 2 0.85,0
SOT96P240X100-3N = smd 1.1 x 0.65: 1 -1.05,0.96; 2 -1.05,-0.96; 3 1.05,0
SOT23-R = smd 0.635 x 1.016: 1 -0.95,-1; 2 0.95,-1; 3 0,1
FSM4JSMATR = smd 1.4 x 2.1: 1 2.25,4.55; 2 2.25,-4.55; 3 -2.25,4.55; 4 -2.25,-4.55
TQFN-12 = smd 0.6 x 0.25: 1 0,0; 2 0,-0.5; 3 0,-1; 7 2.8,-1; 8 2.8,-0.5; 9 2.8,0 | smd 0.25 x 0.6: 4 0.9,-1.9; 5 1.4,-1.9; 6 1.9,-1.9; 10 1.9,0.9; 11 1.4,0.9; 12 0.9,0.9 | smd 1.45 x 1.45: EPAD 1.4,-0.5
QFN-28 = smd 1.15 x 0.27: 1 -2.4,1.5; 2 -2.4,1; 3 -2.4,0.5; 4 -2.4,0; 5 -2.4,-0.5; 6 -2.4,-1; 7 -2.4,-1.5; 15 2.4,-1.5; 16 2.4,-1; 17 2.4,-0.5; 18 2.4,0; 19 2.4,0.5; 20 2.4,1; 21 2.4,1.5 | smd 0.27 x 1.15: 8 -1.5,-2.4; 9 -1,-2.4; 10 -0.5,-2.4; 11 0,-2.4; 12 0.5,-2.4; 13 1,-2.4; 14 1.5,-2.4; 22 1.5,2.4; 23 1,2.4; 24 0.5,2.4; 25 0,2.4; 26 -0.5,2.4; 27 -1,2.4; 28 -1.5,2.4 | smd 3.15 x 3.15: THERMAL 0,0
QFN40P600X600X90-48_N = smd 2 x 0.2: 1 -3.7,2.2; 2 -3.7,1.8; 3 -3.7,1.4; 4 -3.7,1; 5 -3.7,0.6; 6 -3.7,0.2; 7 -3.7,-0.2; 8 -3.7,-0.6; 9 -3.7,-1; 10 -3.7,-1.4; 11 -3.7,-1.8; 12 -3.7,-2.2; 25 3.7,-2.2; 26 3.7,-1.8; 27 3.7,-1.4; 28 3.7,-1; 29 3.7,-0.6; 30 3.7,-0.2; 31 3.7,0.2; 32 3.7,0.6; 33 3.7,1; 34 3.7,1.4; 35 3.7,1.8; 36 3.7,2.2 | smd 0.2 x 2: 13 -2.2,-3.7; 14 -1.8,-3.7; 15 -1.4,-3.7; 16 -1,-3.7; 17 -0.6,-3.7; 18 -0.2,-3.7; 19 0.2,-3.7; 20 0.6,-3.7; 21 1,-3.7; 22 1.4,-3.7; 23 1.8,-3.7; 24 2.2,-3.7; 37 2.2,3.7; 38 1.8,3.7; 39 1.4,3.7; 40 1,3.7; 41 0.6,3.7; 42 0.2,3.7; 43 -0.2,3.7; 44 -0.6,3.7; 45 -1,3.7; 46 -1.4,3.7; 47 -1.8,3.7; 48 -2.2,3.7 | smd 4.7 x 4.7: PAD 0,0 | drill 0.4: PAD@VIA01 -1.8,1.8; PAD@VIA02 -1.8,0.6; PAD@VIA03 -1.8,-0.6; PAD@VIA04 -1.8,-1.8; PAD@VIA05 -0.6,1.8; PAD@VIA06 -0.6,0.6; PAD@VIA07 -0.6,-0.6; PAD@VIA08 -0.6,-1.8; PAD@VIA09 0.6,1.8; PAD@VIA10 0.6,0.6; PAD@VIA11 0.6,-0.6; PAD@VIA12 0.6,-1.8; PAD@VIA13 1.8,1.8; PAD@VIA14 1.8,0.6; PAD@VIA15 1.8,-0.6; PAD@VIA16 1.8,-1.8
ABLS-12.000MHZ-B2 = smd 5.6 x 2.1: 1 -4.75,0; 2 4.75,0
CRYSTAL-SMD-2X6-CYL = smd 2.5 x 6: SHEILD 0,5.08 | smd 1 x 2.5: X1 -1.27,0; X2 1.27,0

### Placement (x,y rotation side)
1.8V  27.5,63.5 0 top
+3.3V  24,63.5 0 top
BATTERY  14.15,2.28 180 top
C1  20.5,28.5 0 top
C2  47,57.5 180 top
C3  20.5,32 0 top
C4  47,60.5 180 top
C6  15,28.5 0 top
C7  46.5,52.5 90 top
C8  46.5,48.5 270 top
C9  46.5,44.5 90 top
C10  48,19 270 top
C11  38,59.5 0 top
C13  23.5,56 180 top
C15  27.5,56 180 top
C16  23.5,46 0 top
C19  21,1.59 0 top
C23  11,8 90 top
C24  32.83,1.41 180 top
C30  41,13.5 180 top
C31  24.5,2.5 90 top
C34  15,25.5 0 top
C39  3.5,10 90 top
C43  15,32 0 top
C44  17,21.5 270 top
C45  10,28.5 0 top
C46  15,16.5 90 top
C47  10,35.5 0 top
C48  7.5,9 180 top
C49  15,8 90 top
C50  10,32 0 top
C51  3.5,14.5 270 top
C52  3.5,19 270 top
D2  33.66,8.64 0 top
GND  31,63.5 0 top
IC1  20.2,8.17 180 top
IC2  29,16.5 0 top
IC3  41.5,19 0 top
IC4  57,7 90 top
J1  2.5,60.5 270 top
J2  33,28.5 0 top
J3  61,32.5 90 top
J6  4.79,5.35 0 top
L1  24,9 90 top
L2  51.5,60 270 top
L3  33,59.5 180 top
L4  28.5,59.5 180 top
LED1  60.5,21 0 top
Q1  21,16.5 0 top
Q3  28.28,2.98 90 top
R1  23.5,21.5 90 top
R2  21,4 0 top
R3  32.76,6.41 180 top
R4  32.84,3.91 180 top
R5  27.5,33.5 0 top
R6  32.5,33.5 0 top
R8  10,25.5 180 top
R10  15,35.5 0 top
R11  41.5,23.5 0 top
R12  15,12 270 top
R13  47,23.5 180 top
R14  37.5,33.5 0 top
R15  36.5,14 270 top
RESET  6.5,63.5 0 top
RXD  10,63.5 0 top
S1  47,6.5 90 top
SW_REG  27,8.83 0 top
SWCLK  17,63.5 0 top
SWDIO  20.5,63.5 0 top
TXD  13.5,63.5 0 top
U$2  10,17.5 0 top
U$5  34.5,48.5 0 top
Y2  52,47.5 90 top
Y3  23.5,51 90 top

### Tracks (layer width: path | path; a pad name or v marks a point on that pad's centre or on a via)
3.3V  (via drill 0.35)  (1 unrouted)
  Top 0.203: v15.53,27.34 14.38,28.48 C6.1 | v17.24,25.62 22,25.62 23.43,24.19 28.67,24.19 32.96,28.48 J2.1 33.05,28.48 34.29,27.24 38.58,27.24 39.34,28 39.34,29.05 | 39.34,29.05 32.29,36.1 32.29,44.77 U$5.13 | v29.05,58.1 32.29,54.86 32.29,52.29 U$5.48 | v37.43,51.53 38.2,50.77 U$5.36 | 34.43,15.38 36.48,13.34 R15.2 | 34.43,15.38 31.72,18.1 27.24,18.1 26.67,17.53 26.67,13.14 28.48,11.34 28.48,9.91 SW_REG.11 28.48,9.81 28.86,9.81 SW_REG.10 28.96,9.72 29.15,9.53 v29.62,9.53 | v25.53,2.38 24.86,1.71 24.57,1.71 C31.1 | S1.1 42.39,8.76 41.72,9.43 41.72,13.43 C30.1 41.81,13.43 44.67,13.43 49.48,18.24 | C10.1 47.91,19.81 47.82,19.91 43.05,19.91 IC3.8 42.96,20 42.39,20.57 39.62,20.57 34.43,15.38 | 49.48,18.24 48.01,19.72 C10.1 | 49.48,18.24 54.05,13.67 | 54.05,13.67 55.05,12.67 55.05,10.67 IC4.8 | 54.05,13.67 61.34,20.95 LED1.2 61.44,21.05 62.29,21.91 62.29,32.96 61.44,33.81 60.48,33.81 59.72,34.58 59.72,39.34 53.15,45.91 50.86,45.91 48.77,43.81 46.58,43.81 C9.1 46.48,43.81 43.05,47.24 v42.1,47.24 | 39.34,29.05 39.43,29.05 40.2,29.81 41.05,29.81 41.91,28.96 41.91,28 45.72,24.19 48.29,24.19 48.48,24 48.48,20.67 47.82,20 C10.1
  Bottom 0.203: v17.24,25.62 v15.53,27.34 | +3.3V.1 24,63.44 24,63.15 v29.05,58.1 30.86,58.1 v37.43,51.53 37.81,51.53 v42.1,47.24 | v25.53,2.38 25.53,5.43 v29.62,9.53
+1.8V  (via drill 0.35)
  Top 0.203: v16.38,13.14 16.38,8.76 15.05,7.43 15.05,7.24 C49.1 | v15.34,14.19 15.34,15.34 15.05,15.62 C46.1 | v13.53,14.95 12.76,14.19 11.24,14.19 11.05,14.38 11.05,15.05 U$2.13 | v27.34,16.48 27.91,17.05 27.91,17.43 IC2.1 | 13.24,26.67 19.34,26.67 21.14,28.48 C1.2 | 13.24,26.67 12.19,25.62 12.19,20.57 11.76,20.14 | 11.76,20.14 11.53,19.91 U$2.22 | 13.24,26.67 13.24,30.96 11.43,32.77 10.19,32.77 9.43,32 9.24,32 C50.1 9.14,32 7.71,32 3.33,36.39 2,36.39 1.24,37.15 1.24,38.2 1.91,38.86 3.43,38.86 | 3.43,38.86 6.76,35.53 9.14,35.53 C47.1 | v7.81,48.48 7.81,43.34 3.43,38.96 3.43,38.86 | 11.76,20.14 v12.19,19.72
  Bottom 0.203: v27.34,16.48 24.19,13.34 16.67,13.34 16.48,13.14 v16.38,13.14 v15.34,14.19 15.24,14.19 14.48,14.95 v13.53,14.95 13.53,18.38 v12.19,19.72 | v7.81,48.48 22.1,62.77 22.1,63.91 23.34,65.15 25.62,65.15 27.24,63.53 27.43,63.53 1.8V.1
AGND
  Top 0.203: 7.62,18.95 7.62,18.57 U$2.2 7.62,18.48 7.62,18.1 U$2.3 7.62,17.91 7.62,17.53 U$2.4 7.62,17.43 7.62,17.05 U$2.5 7.53,17.05 4.29,17.05 | 7.62,18.95 8.48,19.81 U$2.28 | 7.62,18.95 U$2.1 | R8.2 9.24,25.43 7.71,25.43 2.76,20.48 2.76,18.95 3.43,18.29 C52.2 3.52,18.1 4.29,17.34 4.29,17.05 | 4.29,14.67 3.52,13.91 3.52,13.72 C51.2 | 4.29,17.05 4.29,14.67 | 4.29,14.67 5.43,14.67 5.91,14.19 6.67,14.19 7.53,15.05 8.48,15.05 U$2.8
BATT_VOL  (via drill 0.35)  (1 unrouted)
  Top 0.203: 29.24,33.53 31.72,33.53 R6.1 | 29.24,33.53 28.29,33.53 R5.2 | v29.24,34.1 29.24,33.53 | v27.91,35.43 26.77,35.43 17.34,44.86 12.38,44.86 4.38,52.86 2.57,52.86 J1.4
  Bottom 0.203: v27.91,35.43 v29.24,34.1
CH_ENABLE  (via drill 0.35)
  Top 0.203: Q1.1 20,17.53 23.24,20.77 23.43,20.77 R1.1 23.53,20.86 38.77,20.86 v40.39,22.48 | U$5.17 33.91,44.77 33.91,43.62 36.2,41.34 37.05,41.34 43.15,35.24 43.15,28.57 J2.5
  Bottom 0.203: v40.39,22.48 40.39,24.86 43.15,27.62 43.15,28.48 J2.5
CHARGE_STAT  (1 unrouted)
  Top 0.203: R13.2 46.29,23.53 42.29,23.53 R11.2 42.29,23.62 42.29,26.86 40.67,28.48 J2.4
CSB  (via drill 0.35)  (1 unrouted)
  Top 0.203: v12.86,24.38 13.34,23.91 13.34,16.29 13.05,16 12.48,16 U$2.15 | v14.76,29.53 14.76,30 10.38,34.38 5.91,34.38 2.57,37.72 J1.10
  Bottom 0.203: v12.86,24.38 12.86,27.62 v14.76,29.53
ECGN1  (via drill 0.35)
  Top 0.203: R10.2 15.62,35.43 15.62,33.34 14.29,32 C43.1 14.29,31.91 14.29,31.43 v14.86,30.86 | v5.33,13.81 3.52,12 3.52,10.86 C39.2 | v6.38,14.86 7.53,16 U$2.7
  Bottom 0.203: v5.33,13.81 v6.38,14.86 6.38,14.95 5.71,15.62 5.71,21.43 14.86,30.57 v14.86,30.86
ECGP1  (via drill 0.35)
  Top 0.203: v8.38,11.34 14.95,11.34 R12.2 | v6.67,11.34 5.62,11.34 3.52,9.24 C39.1 | v14.86,22.38 16.95,22.38 C44.1 | v6.38,16.38 6.48,16.48 7.53,16.48 U$2.6
  Bottom 0.203: v6.67,11.34 v8.38,11.34 8.38,16.38 | v14.86,22.38 12.86,20.38 11.91,20.38 8.38,16.86 8.38,16.38 | 8.38,16.38 v6.38,16.38
FCLK  (1 unrouted)
  Top 0.203: U$2.14 11.53,15.14 12.76,15.14 13.72,16.1 13.72,24.48 13.24,24.96 13.24,26.1 13.43,26.29 21.91,26.29 23.62,24.57 27.34,24.57 32.58,29.81 36.77,29.81 38.01,28.57 J2.3
GND  (via drill 0.35)  (2 unrouted)
  Top 0.203: 23.43,23.24 23.43,22.29 R1.2 | 23.43,23.24 22.48,24.19 20.48,24.19 18.81,22.53 | 18.81,22.53 17.05,20.77 C44.2 16.95,20.67 15.05,18.76 15.05,17.34 C46.2 15.05,17.24 15.05,17.05 16,16.1 16,13.72 15.72,13.43 15.72,9.72 14.95,8.95 C49.2 14.95,8.86 11.05,8.86 C23.2 10.95,8.76 10.38,8.19 10.19,8.19 | R11.1 40.77,23.43 23.72,23.43 23.53,23.24 23.43,23.24 | 18.81,22.53 15.91,25.43 C34.2 | IC3.7 43.05,19.24 43.05,18.76 IC3.6 43.05,18.67 43.05,18.1 IC3.5 | 40.58,17.43 40.01,18 IC3.4 | 40.58,17.43 42.39,17.43 42.96,18 IC3.5 | 40.58,17.43 40.58,17.34 40.39,17.14 v40.39,15.34 40.39,13.53 C30.2 40.29,13.43 37.91,13.43 37.05,12.57 35.53,12.57 31.62,16.48 30.19,16.48 IC2.3 30.1,16.48 30.1,16.1 33.43,12.76 33.43,6.48 R3.1 | C10.2 47.91,18.19 43.15,18.19 IC3.5 | C43.2 15.72,31.91 v15.72,30.29 15.72,28.57 C6.2 15.81,28.57 19.72,28.57 C1.1 19.72,28.67 21.14,30.1 21.14,31.91 C3.2 21.24,32 22.67,33.43 26.77,33.43 R5.1 | C16.1 22.77,46.01 22.77,48.29 21.91,49.15 21.91,50.29 23.05,51.44 24.86,51.44 25.05,51.63 25.05,53.72 22.86,55.91 C13.2 22.86,56.01 23.62,56.77 24.67,56.77 26.19,55.24 27.34,55.24 28,55.91 28.19,55.91 C15.1 28,56.01 28,58.39 27.34,59.05 27.34,59.91 28.1,60.67 29.24,60.67 31.05,62.48 31.05,63.34 GND.1 31.05,63.44 34.67,63.44 38.58,59.53 38.77,59.53 C11.2 38.86,59.53 39.81,60.48 46.29,60.48 C4.2 | R8.1 10.67,25.43 v10.67,23.62 10.67,21.81 9.53,20.67 9.53,19.91 U$2.26 9.53,19.81 9.53,19.24 9.81,18.95 10.38,18.95 U$2.THERMAL | U$2.12 10.48,15.14 10.48,16.95 10,17.43 U$2.THERMAL | U$2.24 10.48,19.81 10.48,17.91 10.1,17.53 U$2.THERMAL
  Top 0.203: 10.19,8.19 8.1,8.19 6.1,6.19 6.1,5.43 J6.GND | C2.2 46.39,57.44 v46.39,55.44 46.39,53.34 46.48,53.24 C7.2 46.58,53.15 47.43,52.29 47.43,48.86 46.58,48.01 46.58,47.82 C8.2 | 22.86,1.62 21.81,1.62 C19.2 | 22.86,1.62 24.48,3.24 C31.2 | C45.2 10.76,28.57 v10.76,30.29 10.76,31.91 C50.2 | SW_REG.8 29.81,8.29 29.81,7.91 SW_REG.7 29.81,7.81 v29.81,7.14 | v26,8.48 26.1,8.38 26.96,8.38 SW_REG.2 | v21.72,5.05 21.72,4 R2.2 | v38.2,34.48 38.2,33.53 R14.2 | v47.53,45.24 46.58,45.24 C9.2 | v32,2.48 32,1.43 C24.2 | v10.76,36.58 10.76,35.53 C47.2 | v20.19,10.67 20.19,9.53 IC1.2 | v59.82,3.43 58.96,3.43 IC4.4 | v22.95,1.62 22.86,1.62 | U$5.PAD 34.58,48.58 35.05,49.05 U$5.PAD@VIA10 | 10.19,8.19 10.19,3.62 11.53,2.29 BATTERY.2
  pour Bottom: 0,67 0,0 63.5,0 63.5,67
MISO  (via drill 0.35)  (2 unrouted)
  Top 0.203: v55.15,6.76 56.29,5.62 56.29,3.43 IC4.2
  Bottom 0.203: v55.15,6.76 36.1,25.81 36.1,27.05 35.53,27.62 35.53,28.48 J2.2
MOSI  (via drill 0.35)  (1 unrouted)
  Top 0.203: v46.29,12.95 49.53,12.95 53.05,9.43 55.53,9.43 55.72,9.62 55.72,11.53 55.91,11.72 58.1,11.72 58.86,10.95 58.86,10.67 IC4.5 | 30.86,34.77 30.86,46.29 U$5.12 | 30.86,34.77 v30.86,34.2 | v5.81,35.53 6.19,35.53 6.95,34.77 12.29,34.77 13.72,36.2 25.43,36.2 26.86,34.77 30.86,34.77
  Bottom 0.203: v46.29,12.95 30.86,28.38 v30.86,34.2 | v5.81,35.53 2.86,32.58 2.57,32.58 J1.12
N$1
  Top 0.203: SW_REG.9 29.81,8.76 30.19,8.76 30.77,8.19 30.77,5.33 32.1,4 R4.2
N$2
  Top 0.203: R13.1 47.62,23.43 45.15,20.95 39.43,20.95 36.96,18.48 22.67,18.48 21.14,16.95 21.14,9.53 IC1.1
N$3  (via drill 0.35)
  Top 0.203: v18.57,11.72 18.57,8.86 19.81,7.62 19.81,6.29 20.29,5.81 20.29,4 R2.1 | v19.53,12.67 19.53,15.14 19.91,15.53 Q1.2
  Bottom 0.203: v19.53,12.67 v18.57,11.72
N$4
  Top 0.203: C13.1 24.29,55.91 24.96,55.91 30.1,50.77 30.77,50.77 U$5.1
N$5
  Top 0.203: SW_REG.4 27.81,6.95 26.96,7.81 SW_REG.3 26.86,7.81 24.29,7.81 24,8.1 L1.1
N$6
  Top 0.203: 33.62,3.14 33.62,1.43 C24.1 | 33.62,3.14 33.62,3.9 R4.1 33.53,4 33.34,4 31.62,5.71 31.53,5.71 31.34,5.91 31.34,8.19 31.72,8.57 D2.C 31.72,8.67 28,12.38 28,15.53 IC2.2 | SW_REG.5 28.48,6.95 28.86,6.95 SW_REG.6 28.96,6.86 28.96,4.29 29.24,4 Q3.2 29.34,3.9 30.1,3.14 33.62,3.14
N$7
  Top 0.203: Q1.3 22,16.48 22,7.71 21.24,6.95 IC1.5
N$8
  Top 0.203: SW_REG.12 27.91,9.72 27.05,8.86 SW_REG.1 26.96,8.86 26.57,8.86 25.62,9.81 24,9.81 L1.2
N$9
  Top 0.203: C51.1 3.43,15.34 3.43,16.86 2.38,17.91 2.38,20.67 7.91,26.19 11.24,26.19 11.43,26 11.43,22 10,20.57 U$2.25
N$10
  Top 0.203: C2.1 47.72,57.44 47.72,56.48 51.91,52.29 Y2.2
N$11
  Top 0.203: L4.1 29.05,59.53 32.19,59.53 L3.2
N$12  (1 unrouted)
N$13
  Top 0.203: 24.19,49.05 C16.2 | 24.19,49.05 23.53,49.72 Y3.X1 | U$5.3 30.77,49.91 25.15,49.91 24.29,49.05 24.19,49.05
N$14  (via drill 0.35)
  Top 0.203: v25.91,34.67 22.48,34.67 19.81,32 C3.1 | v39.81,48.58 39.81,49.44 39.34,49.91 38.29,49.91 U$5.34 | v39.91,47.24 44.39,42.77 51.91,42.77 Y2.1
  Bottom 0.203: v39.81,48.58 39.2,47.96 | 39.2,47.96 v25.91,34.67 | 39.2,47.96 v39.91,47.24
N$15
  Top 0.203: L2.1 51.44,60.58 47.72,60.58 C4.1
N$16
  Top 0.203: IC3.3 39.91,18.67 39.62,18.67 36.58,15.62 36.58,14.76 R15.1
N$17
  Top 0.203: C34.1 14.19,25.43 14.19,14.67 13.34,13.81 10.67,13.81 10,14.48 10,15.05 U$2.11
N$18
  Top 0.203: C48.1 8.29,9.05 8.29,10.48 7.71,11.05 7.71,12.57 9.43,14.29 9.43,15.05 U$2.10
N$19
  Top 0.203: C45.1 9.24,28.48 9.43,28.48 11.34,26.57 11.43,26.57 11.81,26.19 11.81,21.34 11.05,20.57 11.05,19.91 U$2.23
N$20
  Top 0.203: C52.1 3.52,19.81 7.24,19.81 8.19,20.77 8.76,20.77 8.95,20.57 8.95,19.91 U$2.27
N$22  (1 unrouted)
N$23
  Top 0.203: C48.2 6.76,9.05 6.76,10.48 7.33,11.05 7.33,12.76 8.95,14.38 8.95,15.05 U$2.9
N$24  (1 unrouted)
  Top 0.203: L4.2 28,59.44 28.67,58.77 36.48,58.77 37.15,59.44 C11.1
N$29  (1 unrouted)
P0.03  (1 unrouted)
P0.04  (1 unrouted)
P0.05  (1 unrouted)
P0.16  (1 unrouted)
P0.17  (1 unrouted)
P0.19  (1 unrouted)
P0.22  (1 unrouted)
P0.23  (1 unrouted)
P0.24
  Top 0.203: U$5.29 38.29,47.91 45.15,47.91 46.77,46.29 57.34,46.29 60.96,42.67 J3.5
P0.25  (via drill 0.35)
  Top 0.203: v46.77,50.29 44.86,52.2 36.77,52.2 U$5.37
  Bottom 0.203: v46.77,50.29 55.63,50.29 60.67,45.24 60.96,45.24 J3.6
P0.26
  Top 0.203: U$5.38 36.29,52.29 36.29,53.34 41.15,58.2 50.58,58.2 60.96,47.82 J3.7
P0.27  (1 unrouted)
P0.28  (1 unrouted)
P0.29  (1 unrouted)
P0.30  (1 unrouted)
P0.31
  Top 0.203: U$5.43 34.29,52.29 34.29,53.34 39.81,58.86 59.44,58.86 60.96,60.39 J3.12
RESET  (via drill 0.35)
  Top 0.203: 40.77,44.77 41.24,44.77 55.82,30.19 59.24,30.19 60.87,28.57 J2.12 | 40.77,44.77 36.77,44.77 U$5.24 | v28.96,61.34 17.43,61.34 14,64.77 9.53,64.77 8.29,63.53 6.57,63.53 RESET.1 | v40.77,44.86 40.77,44.77
  Bottom 0.203: v28.96,61.34 42.77,47.53 42.77,46.86 v40.77,44.86
RXD  (1 unrouted)
  Bottom 0.203: J1.9 2.57,40.2 2.57,40.48 7.14,45.05 7.14,60.29 9.91,63.06 9.91,63.44 RXD.1
SCLK  (via drill 0.35)  (2 unrouted)
  Top 0.203: v31.34,15.81 36.58,10.57 36.58,7.91 41.24,3.24 43.62,3.24 45.62,5.24 52.58,5.24 57.63,10.29 57.63,10.57 IC4.6
  Bottom 0.203: v31.34,15.81 24.29,22.86 21.91,22.86 16.38,28.38 16.38,30.57 11.05,35.91 6.38,35.91 6.1,36.2 4,36.2 2.95,35.15 2.57,35.15 J1.11
SF_CS  (1 unrouted)
SHIELD  (via drill 0.35)
  Top 0.203: J6.SHIELD 1.91,5.62 1.91,2.95 2.1,2.76 J6.SHIELD8 2.1,2.67 3.81,2.67 J6.SHIELD3 3.9,2.76 5.71,2.76 J6.SHIELD4 5.81,2.76 7.43,2.76 J6.SHIELD6 7.53,2.86 7.62,2.95 7.62,4.29 | 7.62,4.29 7.62,5.62 J6.SHIELD2 | 7.62,4.29 v8.19,4.29
  Bottom 0.203: J6.SHIELD9 2.29,5.52 2.29,5.24 1.71,4.67 1.71,4.29 1.91,4.1 1.91,2.95 2,2.86 J6.SHIELD5 2.1,2.86 7.43,2.86 J6.SHIELD7 7.53,2.86 7.53,3.43 8.1,4 8.1,4.29 | 8.1,4.29 8.1,4.57 7.53,5.14 7.53,5.24 7.24,5.52 J6.SHIELD10 | v8.19,4.29 8.1,4.29
SWDCLK
  Top 0.203: U$5.25 38.29,46.29 40.29,46.29 54.01,32.58 60.96,32.58 J3.1
SWDIO  (1 unrouted)
  Top 0.203: J3.2 61.05,35.05 61.05,35.91 62.29,37.15 62.29,60.96 58.48,64.77 21.81,64.77 20.57,63.53 SWDIO.1
SWITCHA  (via drill 0.35)
  Top 0.203: v36.77,40.67 36.77,33.53 R14.1 | U$5.23 36.29,44.77 36.29,43.62 36.77,43.15 v36.77,42.01 43.43,42.01 55.63,29.81 57.15,29.81 58.39,28.57 J2.11 | v49.44,17.24 45.62,13.43 45.62,9.72 42.48,6.57 42.48,4.29 S1.3
  Bottom 0.203: v36.77,42.01 v36.77,40.67 | v49.44,17.24 49.44,18.67 58.39,27.62 58.39,28.48 J2.11
SWO  (1 unrouted)
TXD
  Top 0.203: 1.91,54.1 3.71,54.1 12.57,45.24 24.67,45.24 27.34,47.91 30.77,47.91 U$5.8 | 1.91,54.1 1.24,53.44 1.24,44.01 2.48,42.77 J1.8 | TXD.1 13.43,63.44 11.72,63.44 7.53,59.24 2,59.24 1.24,58.48 1.24,54.86 1.91,54.2 1.91,54.1
V_BATT  (via drill 0.35)
  Top 0.203: 17.14,1.62 14.76,1.62 14.19,2.19 BATTERY.1 | 17.14,1.62 20.19,1.62 C19.1 | v23.91,25.24 24.77,25.24 32.96,33.43 33.15,33.43 R6.2 | v22.19,23.53 22.19,21.05 18.86,17.72 18.86,12.38 | 18.86,12.38 19.24,12 19.24,9.53 IC1.3 19.34,9.43 19.34,9.05 20.19,8.19 20.19,6.48 20.77,5.91 24,5.91 26.86,3.05 27.24,3.05 Q3.3 | 17.14,1.62 17.14,11.24 18.29,12.38 18.86,12.38
  Bottom 0.203: v22.19,23.53 v23.91,25.24
VBUS  (via drill 0.35)
  Top 0.254: 33.15,5.62 34,5.62 35.43,7.05 35.43,8.57 D2.A | 33.15,5.62 32.86,5.62 32.1,6.38 R3.2 | v16.48,6.29 14.48,6.29 13.62,7.14 11.05,7.14 C23.1 | v17.81,6.29 19.24,6.29 IC1.4 19.34,6.86 19.34,3.62 19.72,3.24 22.29,3.24 23.24,4.19 25.05,4.19 25.34,3.9 25.34,3.62 26.86,2.1 29.24,2.1 Q3.1 29.34,2.1 29.72,2.48 v30.48,2.48 | v6.86,7.91 5.14,7.91 3.52,6.29 3.52,5.43 J6.VBUS | v33.15,5.14 33.15,5.62
  Bottom 0.254: v17.81,6.29 v16.48,6.29 16.38,6.29 14.76,7.91 v6.86,7.91 | v30.48,2.48 v33.15,5.14
XL1  (1 unrouted)
  Top 0.203: 22,56.48 22.67,57.15 24.86,57.15 26,56.01 26.77,56.01 C15.2 | 22,56.48 22,53.72 23.43,52.29 Y3.X2 | J1.2 2.57,57.91 20.48,57.91 21.91,56.48 22,56.48